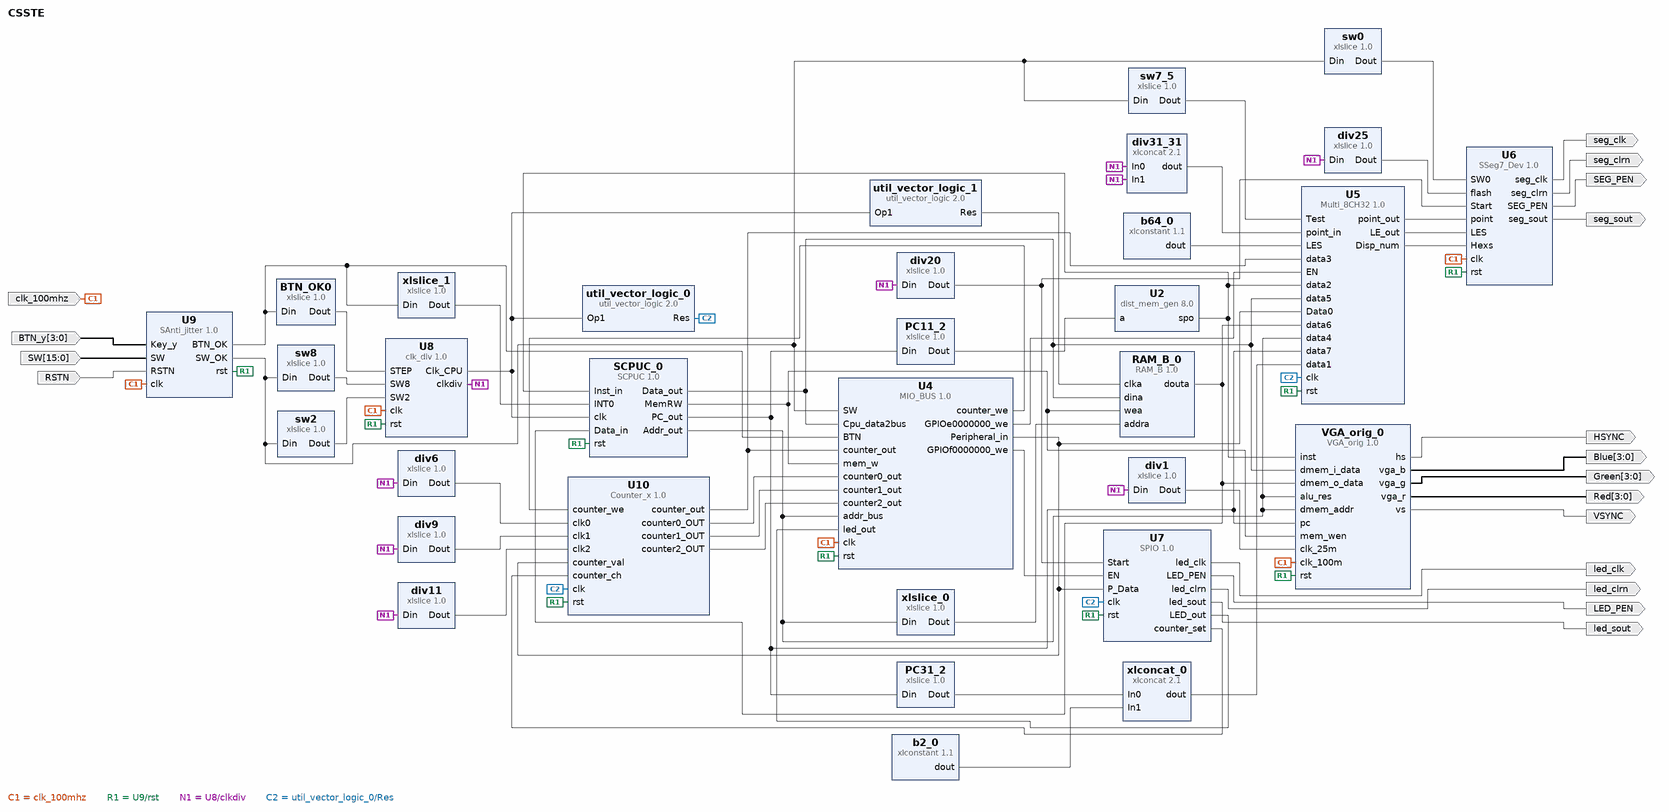
[diagram p0: block diagram of the top level]
# Vivado block design CSSTE, xc7k160tffg676-2L, Vivado 2020.2
create_bd_design CSSTE

create_bd_port -dir I -from 3 -to 0 BTN_y
create_bd_port -dir I -from 15 -to 0 SW
create_bd_port -dir I -type rst RSTN
set_property -dict {CONFIG.POLARITY ACTIVE_HIGH} [get_bd_ports RSTN]
create_bd_port -dir I -type clk clk_100mhz
create_bd_port -dir O -type clk seg_clk
create_bd_port -dir O seg_clrn
create_bd_port -dir O SEG_PEN
create_bd_port -dir O seg_sout
create_bd_port -dir O HSYNC
create_bd_port -dir O VSYNC
create_bd_port -dir O -from 3 -to 0 Red
create_bd_port -dir O -from 3 -to 0 Green
create_bd_port -dir O -from 3 -to 0 Blue
create_bd_port -dir O LED_PEN
create_bd_port -dir O -type clk led_clk
create_bd_port -dir O led_clrn
create_bd_port -dir O led_sout

create_bd_cell -type ip -vlnv xilinx.com:user:MIO_BUS:1.0 U4
create_bd_cell -type ip -vlnv xilinx.com:user:Multi_8CH32:1.0 U5
create_bd_cell -type ip -vlnv xilinx.com:user:SPIO:1.0 U7
create_bd_cell -type ip -vlnv xilinx.com:user:SAnti_jitter:1.0 U9
create_bd_cell -type ip -vlnv xilinx.com:user:Counter_x:1.0 U10
create_bd_cell -type ip -vlnv xilinx.com:user:SSeg7_Dev:1.0 U6
create_bd_cell -type ip -vlnv xilinx.com:user:clk_div:1.0 U8
create_bd_cell -type ip -vlnv xilinx.com:ip:dist_mem_gen:8.0 U2
set_property -dict [list \
  CONFIG.coefficient_file ../../../../../../../inter_mem.coe \
  CONFIG.data_width 32 \
  CONFIG.depth 1024 \
  CONFIG.input_options non_registered \
  CONFIG.memory_type rom \
] [get_bd_cells U2]
create_bd_cell -type ip -vlnv xilinx.com:ip:xlslice:1.0 div20
set_property -dict {CONFIG.DIN_FROM 20 CONFIG.DIN_TO 20 CONFIG.DOUT_WIDTH 1} [get_bd_cells div20]
create_bd_cell -type ip -vlnv xilinx.com:ip:xlslice:1.0 div1
set_property -dict {CONFIG.DIN_FROM 1 CONFIG.DIN_TO 1 CONFIG.DOUT_WIDTH 1} [get_bd_cells div1]
create_bd_cell -type ip -vlnv xilinx.com:ip:xlslice:1.0 div25
set_property -dict {CONFIG.DIN_FROM 25 CONFIG.DIN_TO 25 CONFIG.DOUT_WIDTH 1} [get_bd_cells div25]
create_bd_cell -type ip -vlnv xilinx.com:ip:xlslice:1.0 sw0
set_property -dict {CONFIG.DIN_WIDTH 16} [get_bd_cells sw0]
create_bd_cell -type ip -vlnv xilinx.com:ip:xlslice:1.0 sw7_5
set_property -dict {CONFIG.DIN_FROM 7 CONFIG.DIN_TO 5 CONFIG.DIN_WIDTH 16 CONFIG.DOUT_WIDTH 3} [get_bd_cells sw7_5]
create_bd_cell -type ip -vlnv xilinx.com:ip:xlslice:1.0 sw8
set_property -dict {CONFIG.DIN_FROM 8 CONFIG.DIN_TO 8 CONFIG.DIN_WIDTH 16 CONFIG.DOUT_WIDTH 1} [get_bd_cells sw8]
create_bd_cell -type ip -vlnv xilinx.com:ip:util_vector_logic:2.0 util_vector_logic_0
set_property -dict {CONFIG.C_OPERATION not CONFIG.C_SIZE 1} [get_bd_cells util_vector_logic_0]
create_bd_cell -type ip -vlnv xilinx.com:ip:xlconcat:2.1 div31_31
set_property -dict {CONFIG.IN0_WIDTH 32 CONFIG.IN1_WIDTH 32 CONFIG.dout_width 64} [get_bd_cells div31_31]
create_bd_cell -type ip -vlnv xilinx.com:ip:xlconcat:2.1 xlconcat_0
set_property -dict {CONFIG.IN0_WIDTH 30 CONFIG.IN1_WIDTH 2 CONFIG.dout_width 32} [get_bd_cells xlconcat_0]
create_bd_cell -type ip -vlnv xilinx.com:ip:xlconstant:1.1 b64_0
set_property -dict {CONFIG.CONST_VAL 0 CONFIG.CONST_WIDTH 64} [get_bd_cells b64_0]
create_bd_cell -type ip -vlnv xilinx.com:ip:xlconstant:1.1 b2_0
set_property -dict {CONFIG.CONST_VAL 0 CONFIG.CONST_WIDTH 2} [get_bd_cells b2_0]
create_bd_cell -type ip -vlnv xilinx.com:ip:xlslice:1.0 BTN_OK0
set_property -dict {CONFIG.DIN_WIDTH 4} [get_bd_cells BTN_OK0]
create_bd_cell -type ip -vlnv xilinx.com:ip:xlslice:1.0 sw2
set_property -dict {CONFIG.DIN_FROM 2 CONFIG.DIN_TO 2 CONFIG.DIN_WIDTH 16 CONFIG.DOUT_WIDTH 1} [get_bd_cells sw2]
create_bd_cell -type ip -vlnv xilinx.com:ip:xlslice:1.0 PC11_2
set_property -dict {CONFIG.DIN_FROM 11 CONFIG.DIN_TO 2 CONFIG.DOUT_WIDTH 10} [get_bd_cells PC11_2]
create_bd_cell -type ip -vlnv xilinx.com:ip:xlslice:1.0 div6
set_property -dict {CONFIG.DIN_FROM 6 CONFIG.DIN_TO 6 CONFIG.DOUT_WIDTH 1} [get_bd_cells div6]
create_bd_cell -type ip -vlnv xilinx.com:ip:xlslice:1.0 div9
set_property -dict {CONFIG.DIN_FROM 9 CONFIG.DIN_TO 9 CONFIG.DOUT_WIDTH 1} [get_bd_cells div9]
create_bd_cell -type ip -vlnv xilinx.com:ip:xlslice:1.0 div11
set_property -dict {CONFIG.DIN_FROM 11 CONFIG.DIN_TO 11 CONFIG.DOUT_WIDTH 1} [get_bd_cells div11]
create_bd_cell -type ip -vlnv xilinx.com:ip:xlslice:1.0 PC31_2
set_property -dict {CONFIG.DIN_FROM 31 CONFIG.DIN_TO 2 CONFIG.DOUT_WIDTH 30} [get_bd_cells PC31_2]
create_bd_cell -type ip -vlnv xilinx.com:user:RAM_B:1.0 RAM_B_0
create_bd_cell -type ip -vlnv xilinx.com:ip:xlslice:1.0 xlslice_0
set_property -dict {CONFIG.DIN_FROM 11 CONFIG.DIN_TO 2 CONFIG.DOUT_WIDTH 10} [get_bd_cells xlslice_0]
create_bd_cell -type ip -vlnv xilinx.com:user:VGA_orig:1.0 VGA_orig_0
create_bd_cell -type ip -vlnv xilinx.com:ip:xlslice:1.0 xlslice_1
set_property -dict {CONFIG.DIN_FROM 1 CONFIG.DIN_TO 1 CONFIG.DIN_WIDTH 4 CONFIG.DOUT_WIDTH 1} [get_bd_cells xlslice_1]
create_bd_cell -type ip -vlnv xilinx.com:ip:util_vector_logic:2.0 util_vector_logic_1
set_property -dict {CONFIG.C_OPERATION not CONFIG.C_SIZE 1} [get_bd_cells util_vector_logic_1]
create_bd_cell -type ip -vlnv xilinx.com:user:SCPUC:1.0 SCPUC_0

# ---- connections ----

connect_bd_net -net Key_y_0_1 [get_bd_ports BTN_y] [get_bd_pins U9/Key_y]
connect_bd_net -net SW_0_1 [get_bd_ports SW] [get_bd_pins U9/SW]
connect_bd_net -net RSTN_0_1 [get_bd_ports RSTN] [get_bd_pins U9/RSTN]
connect_bd_net -net clk_0_1 [get_bd_ports clk_100mhz] \
  [get_bd_pins U9/clk] [get_bd_pins U4/clk] [get_bd_pins U6/clk] [get_bd_pins U8/clk] [get_bd_pins VGA_orig_0/clk_100m]
connect_bd_net [get_bd_pins U9/BTN_OK] [get_bd_pins U4/BTN] [get_bd_pins BTN_OK0/Din] [get_bd_pins xlslice_1/Din]
connect_bd_net [get_bd_pins U9/SW_OK] [get_bd_pins U4/SW] [get_bd_pins sw0/Din] [get_bd_pins sw7_5/Din] [get_bd_pins sw8/Din] [get_bd_pins sw2/Din]
connect_bd_net [get_bd_pins BTN_OK0/Dout] [get_bd_pins U8/STEP]
connect_bd_net [get_bd_pins sw8/Dout] [get_bd_pins U8/SW8]
connect_bd_net [get_bd_pins sw2/Dout] [get_bd_pins U8/SW2]
connect_bd_net [get_bd_pins U9/rst] \
  [get_bd_pins U10/rst] [get_bd_pins U4/rst] [get_bd_pins U5/rst] [get_bd_pins U7/rst] [get_bd_pins U6/rst] \
  [get_bd_pins U8/rst] [get_bd_pins VGA_orig_0/rst] [get_bd_pins SCPUC_0/rst]
connect_bd_net [get_bd_pins U2/spo] [get_bd_pins U5/data2] [get_bd_pins VGA_orig_0/inst] [get_bd_pins SCPUC_0/Inst_in]
connect_bd_net [get_bd_pins U8/clkdiv] \
  [get_bd_pins div20/Din] [get_bd_pins div1/Din] [get_bd_pins div25/Din] [get_bd_pins div31_31/In0] \
  [get_bd_pins div31_31/In1] [get_bd_pins div6/Din] [get_bd_pins div9/Din] [get_bd_pins div11/Din]
connect_bd_net [get_bd_pins util_vector_logic_0/Res] [get_bd_pins U10/clk] [get_bd_pins U5/clk] [get_bd_pins U7/clk]
connect_bd_net [get_bd_pins div6/Dout] [get_bd_pins U10/clk0]
connect_bd_net [get_bd_pins div9/Dout] [get_bd_pins U10/clk1]
connect_bd_net [get_bd_pins div11/Dout] [get_bd_pins U10/clk2]
connect_bd_net [get_bd_pins U4/counter_we] [get_bd_pins U10/counter_we]
connect_bd_net [get_bd_pins U7/counter_set] [get_bd_pins U10/counter_ch]
connect_bd_net [get_bd_pins U5/point_out] [get_bd_pins U6/point]
connect_bd_net [get_bd_pins U5/LE_out] [get_bd_pins U6/LES]
connect_bd_net [get_bd_pins U5/Disp_num] [get_bd_pins U6/Hexs]
connect_bd_net [get_bd_pins U6/seg_clk] [get_bd_ports seg_clk]
connect_bd_net [get_bd_pins U6/seg_clrn] [get_bd_ports seg_clrn]
connect_bd_net [get_bd_pins U6/SEG_PEN] [get_bd_ports SEG_PEN]
connect_bd_net [get_bd_pins U6/seg_sout] [get_bd_ports seg_sout]
connect_bd_net [get_bd_pins div20/Dout] [get_bd_pins U7/Start] [get_bd_pins U6/Start]
connect_bd_net [get_bd_pins div1/Dout] [get_bd_pins VGA_orig_0/clk_25m]
connect_bd_net [get_bd_pins U7/LED_out] [get_bd_pins U4/led_out]
connect_bd_net [get_bd_pins U10/counter_out] [get_bd_pins U4/counter_out] [get_bd_pins U5/data3]
connect_bd_net [get_bd_pins U10/counter0_OUT] [get_bd_pins U4/counter0_out]
connect_bd_net [get_bd_pins U10/counter1_OUT] [get_bd_pins U4/counter1_out]
connect_bd_net [get_bd_pins U10/counter2_OUT] [get_bd_pins U4/counter2_out]
connect_bd_net [get_bd_pins div31_31/dout] [get_bd_pins U5/point_in]
connect_bd_net [get_bd_pins b64_0/dout] [get_bd_pins U5/LES]
connect_bd_net [get_bd_pins U4/GPIOe0000000_we] [get_bd_pins U5/EN]
connect_bd_net [get_bd_pins U4/GPIOf0000000_we] [get_bd_pins U7/EN]
connect_bd_net [get_bd_pins U4/Peripheral_in] [get_bd_pins U7/P_Data] [get_bd_pins U10/counter_val] [get_bd_pins U5/Data0]
connect_bd_net [get_bd_pins U7/LED_PEN] [get_bd_ports LED_PEN]
connect_bd_net [get_bd_pins U7/led_clk] [get_bd_ports led_clk]
connect_bd_net [get_bd_pins U7/led_clrn] [get_bd_ports led_clrn]
connect_bd_net [get_bd_pins U7/led_sout] [get_bd_ports led_sout]
connect_bd_net [get_bd_pins div25/Dout] [get_bd_pins U6/flash]
connect_bd_net [get_bd_pins sw0/Dout] [get_bd_pins U6/SW0]
connect_bd_net [get_bd_pins sw7_5/Dout] [get_bd_pins U5/Test]
connect_bd_net [get_bd_pins xlconcat_0/dout] [get_bd_pins U5/data1]
connect_bd_net [get_bd_pins PC31_2/Dout] [get_bd_pins xlconcat_0/In0]
connect_bd_net [get_bd_pins b2_0/dout] [get_bd_pins xlconcat_0/In1]
connect_bd_net [get_bd_pins PC11_2/Dout] [get_bd_pins U2/a]
connect_bd_net -net pCPU_0_MemRW_ex [get_bd_pins SCPUC_0/MemRW] [get_bd_pins U4/mem_w] [get_bd_pins RAM_B_0/wea] [get_bd_pins VGA_orig_0/mem_wen]
connect_bd_net [get_bd_pins RAM_B_0/douta] [get_bd_pins VGA_orig_0/dmem_o_data] [get_bd_pins U5/data6] [get_bd_pins SCPUC_0/Data_in]
connect_bd_net [get_bd_pins xlslice_0/Dout] [get_bd_pins RAM_B_0/addra]
connect_bd_net [get_bd_pins SCPUC_0/PC_out] [get_bd_pins VGA_orig_0/pc] [get_bd_pins U5/data7] [get_bd_pins PC11_2/Din] [get_bd_pins PC31_2/Din]
connect_bd_net [get_bd_pins VGA_orig_0/hs] [get_bd_ports HSYNC]
connect_bd_net [get_bd_pins VGA_orig_0/vs] [get_bd_ports VSYNC]
connect_bd_net [get_bd_pins VGA_orig_0/vga_r] [get_bd_ports Red]
connect_bd_net [get_bd_pins VGA_orig_0/vga_g] [get_bd_ports Green]
connect_bd_net [get_bd_pins VGA_orig_0/vga_b] [get_bd_ports Blue]
connect_bd_net [get_bd_pins SCPUC_0/Data_out] \
  [get_bd_pins VGA_orig_0/dmem_i_data] [get_bd_pins RAM_B_0/dina] [get_bd_pins U5/data5] [get_bd_pins U4/Cpu_data2bus]
connect_bd_net [get_bd_pins SCPUC_0/Addr_out] \
  [get_bd_pins xlslice_0/Din] [get_bd_pins VGA_orig_0/alu_res] [get_bd_pins VGA_orig_0/dmem_addr] [get_bd_pins U5/data4] \
  [get_bd_pins U4/addr_bus]
connect_bd_net [get_bd_pins U8/Clk_CPU] [get_bd_pins util_vector_logic_1/Op1] [get_bd_pins util_vector_logic_0/Op1] [get_bd_pins SCPUC_0/clk]
connect_bd_net [get_bd_pins util_vector_logic_1/Res] [get_bd_pins RAM_B_0/clka]
connect_bd_net [get_bd_pins xlslice_1/Dout] [get_bd_pins SCPUC_0/INT0]

validate_bd_design
save_bd_design
